# EAGLE design main (EAGLE 7.7.0)
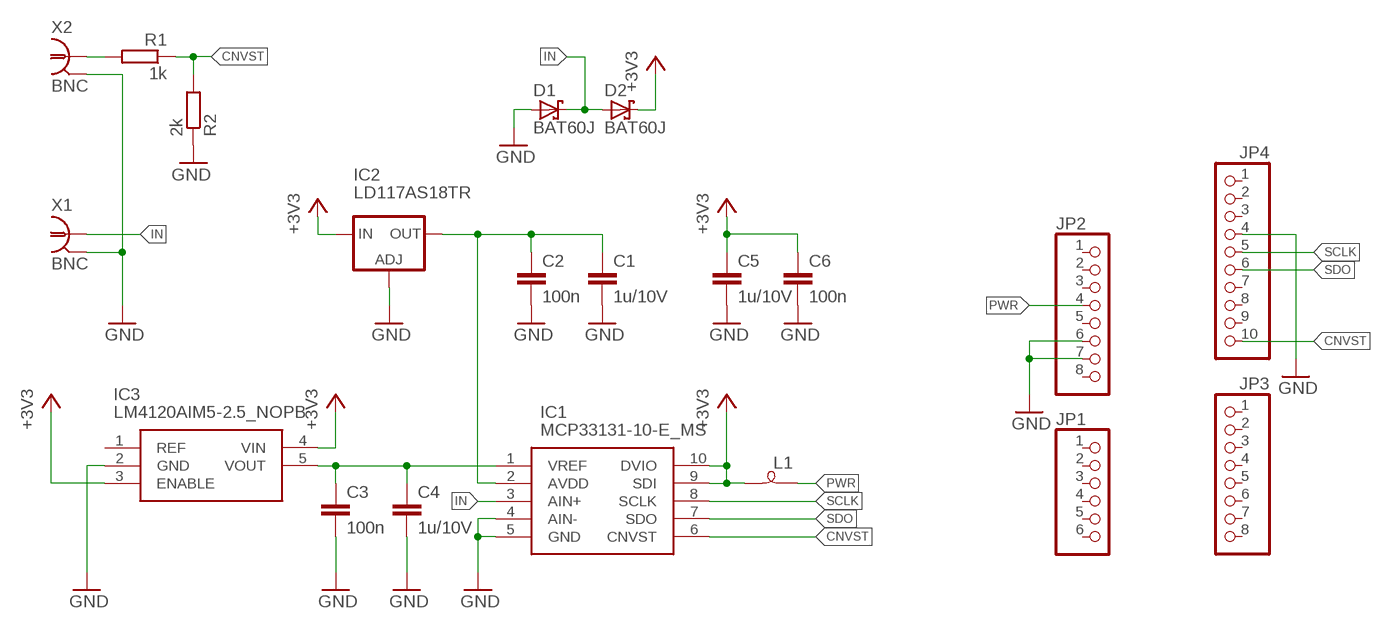
[diagram p0: schematic, sheet 1]

## Parts
C1  1u/10V  C-EUC1206  [C1206]
C2  100n  C-EUC0805  [C0805]
C3  100n  C-EUC0805  [C0805]
C4  1u/10V  C-EUC1206  [C1206]
C5  1u/10V  C-EUC1206  [C1206]
C6  100n  C-EUC0805  [C0805]
D1  BAT60J  [SOD323_ST]
D2  BAT60J  [SOD323_ST]
IC1  MCP33131-10-E_MS  [SOP50P490X110-10N]
IC2  LD117AS18TR  [SOT223]
IC3  LM4120AIM5-2.5_NOPB  [SOT95P280X145-5N]
JP1  PINHD-1X6  [1X06]
JP2  PINHD-1X8  [1X08]
JP3  PINHD-1X8  [1X08]
JP4  PINHD-1X10  [1X10]
L1  SM-B5  [SM-B5]
R1  1k  R-EU_R0805  [R0805]
R2  2k  R-EU_R0805  [R0805]
X1  BNC  1-227161-2  [AMP_227161]
X2  BNC  1-227161-2  [AMP_227161]

## Nets
+3V3: C5.1 C6.1 D2.C IC1.9(SDI) IC1.10(DVIO) IC2.3(IN) IC3.3(ENABLE) IC3.4(VIN) L1.2
CNVST: IC1.6(CNVST) JP4.10 R1.1 R2.2
GND: C1.2 C2.2 C3.2 C4.2 C5.2 C6.2 D1.A IC1.4(AIN-) IC1.5(GND) IC2.1(ADJ) IC3.2(GND) JP2.6 JP2.7 JP4.4 R2.1 X1.2 X2.2
IN: D1.C D2.A IC1.3(AIN+) X1.1
N$1: C3.1 C4.1 IC1.1(VREF) IC3.5(VOUT)
N$2: C1.1 C2.1 IC1.2(AVDD) IC2.4(OUT)
N$4: R1.2 X2.1
PWR: JP2.4 L1.1
SCLK: IC1.8(SCLK) JP4.5
SDO: IC1.7(SDO) JP4.6
Unconnected: IC3.1(REF) JP1.1 JP1.2 JP1.3 JP1.4 JP1.5 JP1.6 JP2.1 JP2.2 JP2.3 JP2.5 JP2.8 JP3.1 JP3.2 JP3.3 JP3.4 JP3.5 JP3.6 JP3.7 JP3.8 JP4.1 JP4.2 JP4.3 JP4.7 JP4.8 JP4.9

## Library data of the parts
C1-C6 = rcl:C-EU: CAPACITOR, European symbol
D1 D2 = diode:BAT60J: Schottky barrier diode Source: www.st.com, BAT60J.pdf
IC1 = SamacSys_Parts:MCP33131-10-E_MS: Analog to Digital Converters - ADC 16-bit, 1 Msps, single channel, single-ended SAR ADC Source: Datasheet <http://ww1.microchip.com/downloads/en/DeviceDoc/MCP33131D-Data-Sheet-DS20005947B.pdf>; DESCRIPTION: Analog to Digital Converters - ADC 16-bit, 1 Msps, single channel, single-ended SAR ADC; HEIGHT: 1.1mm; MANUFACTURER_NAME: Microchip; MANUFACTURER_PART_NUMBER: MCP33131-10-E/MS; MOUSER_PART_NUMBER: 579-MCP33131-10-E/MS; MOUSER_PRICE-STOCK: https://www.mouser.co.uk/ProductDetail/Microchip-Technology-Atmel/MCP33131-10-E-MS?qs=byeeYqUIh0P8g72Pz2M%252Brg%3D%3D
IC2 = v-reg:LD117A?*: Low drop fixed and adjustable positive voltage regulators 1 A Source: http://www.st.com/stonline/products/literature/ds/7194/ld1117axx.pdf
IC3 = SamacSys_Parts:LM4120AIM5-2.5_NOPB: 0.2% 50ppm/C Drift Precision Series Voltage Reference with Shutdown Enable Source: Datasheet <http://www.ti.com/lit/ds/symlink/lm4120.pdf>; DESCRIPTION: 0.2% 50ppm/C Drift Precision Series Voltage Reference with Shutdown Enable; HEIGHT: 1.45mm; MANUFACTURER_NAME: Texas Instruments; MANUFACTURER_PART_NUMBER: LM4120AIM5-2.5/NOPB; MOUSER_PART_NUMBER: 926-LM4120AIM525NOPB; MOUSER_PRICE-STOCK: https://www.mouser.co.uk/ProductDetail/Texas-Instruments/LM4120AIM5-25-NOPB?qs=QbsRYf82W3Hmk5wgD0l3%2Fg%3D%3D
JP1 = pinhead:PINHD-1X6: PIN HEADER
JP2 JP3 = pinhead:PINHD-1X8: PIN HEADER
JP4 = pinhead:PINHD-1X10: PIN HEADER
L1 = inductor-neosid:SM-B: INDUCTOR SMD Bead inductor; OC_FARNELL: unknown; OC_NEWARK: unknown
R1 R2 = resistor:R-EU_: RESISTOR, European symbol
X1 X2 = con-coax:?227161*: JACK, RIGHT ANGLE, 50 OHM, PCB, BNC Source: amp_227161.pdf; OC_FARNELL: unknown; OC_NEWARK: unknown

## Board
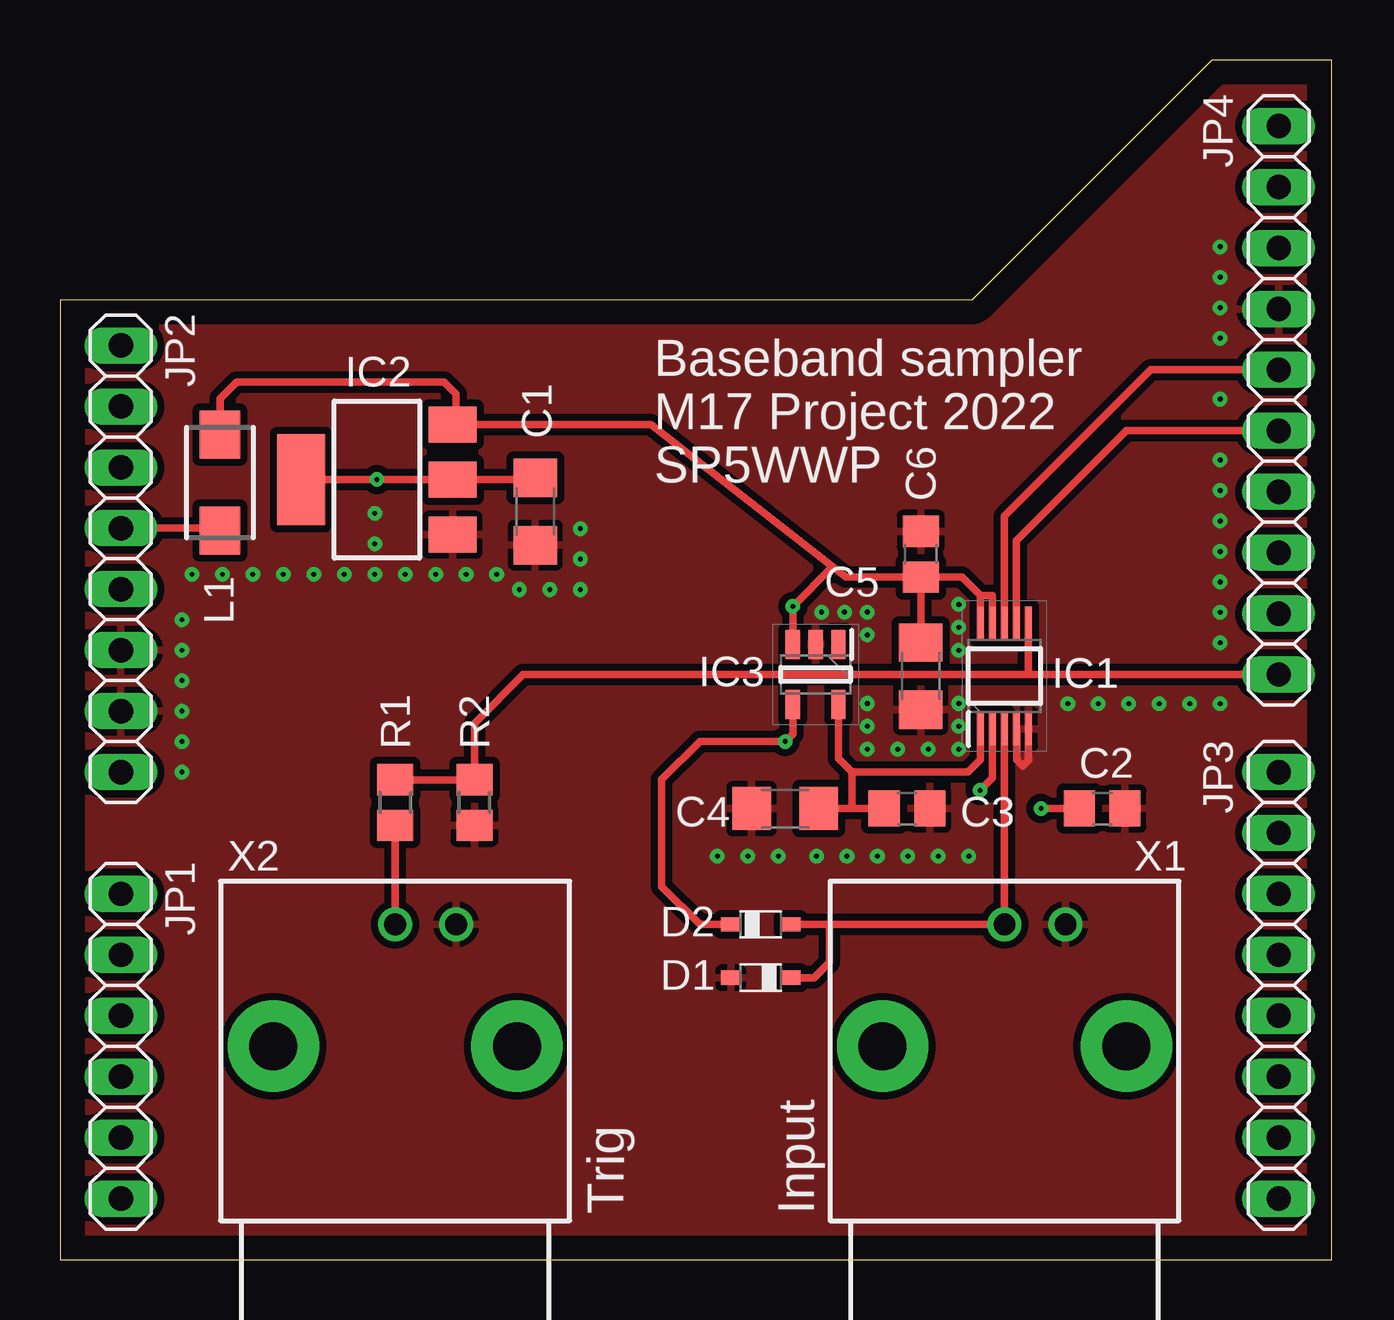
[diagram p1: board, top side]
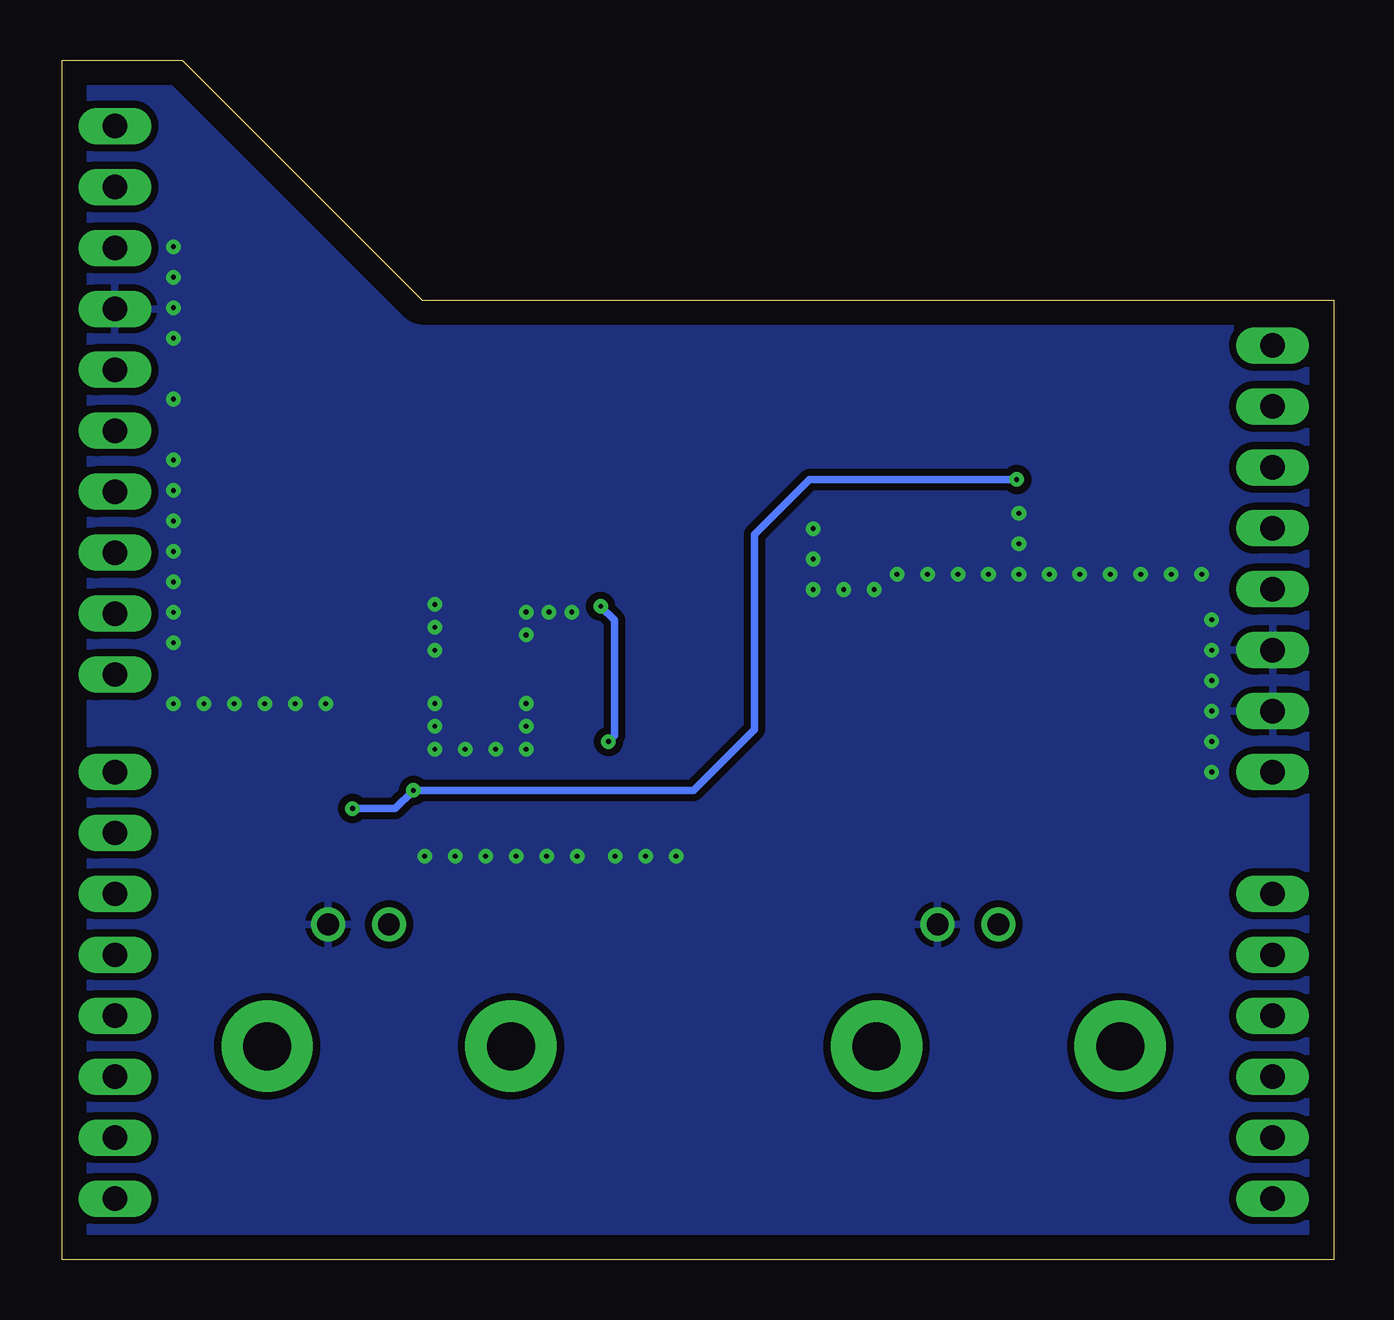
[diagram p2: board, bottom side, seen from below]

Size 53 x 50 mm. Coordinates in mm from the lower left corner, seen from the top.
Outline: 0,0 53,0 53,50 48,50 38,40 0,40 0,0
Copper layers (1*16): Top 0.035mm / dielectric 1.5mm / Bottom 0.035mm
Design rules "default *": minimum track width 10mil, minimum drill 24mil, track to track 8mil, track to pad 8mil, pad to pad 8mil, via to via 8mil, smd to smd 8mil, copper to edge 40mil, drill to drill 8mil, minimum pad ring 10mil, minimum via ring 8mil, stop-mask expansion 4mil, vias tented up to drill 0.2mm, thermal gap 10mil

### Footprints (pad centres in the part's own frame; a part is rotated, then mirrored left to right if it is on the bottom)
C1206 = smd 1.6 x 1.8: 1 -1.4,0; 2 1.4,0
C0805 = smd 1.3 x 1.5: 1 -0.95,0; 2 0.95,0
SOD323_ST = smd 0.8 x 0.6: A 1.25,0; C -1.25,0
SOP50P490X110-10N = smd 1.4 x 0.3: 1 -2.2,1; 2 -2.2,0.5; 3 -2.2,0; 4 -2.2,-0.5; 5 -2.2,-1; 6 2.2,-1; 7 2.2,-0.5; 8 2.2,0; 9 2.2,0.5; 10 2.2,1
SOT223 = smd 1.5 x 2: 1 -2.3,-3.15; 2 0,-3.15; 3 2.3,-3.15 | smd 3.8 x 2: 4 0,3.15
SOT95P280X145-5N = smd 1.2 x 0.6: 1 -1.25,0.95; 2 -1.25,0; 3 -1.25,-0.95; 4 1.25,-0.95; 5 1.25,0.95
1X06 = drill 1.016 long: 1 -6.35,0; 2 -3.81,0; 3 -1.27,0; 4 1.27,0; 5 3.81,0; 6 6.35,0
1X08 = drill 1.016 long: 1 -8.89,0; 2 -6.35,0; 3 -3.81,0; 4 -1.27,0; 5 1.27,0; 6 3.81,0; 7 6.35,0; 8 8.89,0
1X10 = drill 1.016 long: 1 -11.43,0; 2 -8.89,0; 3 -6.35,0; 4 -3.81,0; 5 -1.27,0; 6 1.27,0; 7 3.81,0; 8 6.35,0; 9 8.89,0; 10 11.43,0
SM-B5 = smd 2 x 1.7: 1 -2,0; 2 2,0
R0805 = smd 1.3 x 1.5: 1 -0.95,0; 2 0.95,0
AMP_227161 = drill 0.9 pad 1.27: 1 0,-5.08; 2 -2.54,-5.08 | drill 2 pad 3.81: P$1 -5.08,0; P$2 5.08,0

### Placement (x,y rotation side)
C1  19.81,31.18 270 top
C2  43.43,18.8 0 top
C3  35.31,18.8 0 top
C4  30.23,18.8 180 top
C5  35.88,24.32 270 top
C6  35.88,29.4 90 top
D1  29.21,11.75 180 top
D2  29.21,13.97 0 top
IC1  39.37,24.32 90 top
IC2  13.21,32.51 90 top
IC3  31.5,24.38 270 top
JP1  2.54,8.89 270 top
JP2  2.54,29.21 270 top
JP3  50.8,11.43 270 top
JP4  50.8,35.81 270 top
L1  6.67,32.38 90 top
R1  13.97,19.05 270 top
R2  17.27,19.05 90 top
X1  39.37,8.89 180 top
X2  13.97,8.89 180 top

### Tracks (layer width: path | path; a pad name or v marks a point on that pad's centre or on a via)
+3V3  (via drill 0.2)
  Top 0.305: C6.1 C5.1 | C6.1 37.59,28.45 38.37,27.67 | 38.37,27.67 IC1.10 | C6.1 32.77,28.45 32.2,28.89 | 32.2,28.89 24.64,34.8 16.37,34.8 IC2.3 16.51,34.96 16.51,36.07 16,36.58 7.37,36.58 6.67,35.88 L1.2 | IC3.3 v30.55,27.23 32.2,28.89 | IC1.9 38.87,27.68 38.86,27.69 38.39,27.69 38.37,27.67 | IC3.4 30.55,21.91 v30.23,21.59 26.67,21.59 25.08,20 25.08,15.56 26.67,13.97 D2.C
  Bottom 0.305: v30.23,21.59 29.97,21.84 29.97,26.66 v30.55,27.23
CNVST
  Top 0.305: JP4.10 40.37,24.38 | 40.37,24.38 IC1.6 | 40.37,24.38 19.3,24.38 17.27,22.35 R2.2 R1.1
GND  (via drill 0.2)
  Top 0.305: IC1.4 39.88,20.83 40.13,20.57 40.39,20.83 40.37,20.84 IC1.5
  other vias: 33.66,23.18 33.66,22.23 33.66,21.27 34.92,21.27 36.2,21.27 37.47,21.27 37.47,22.23 37.47,23.18 31.75,26.99 32.7,26.99 33.66,26.99 33.66,26.04 37.47,26.35 37.47,27.3 37.47,25.4 48.36,35.87 48.36,32.05 48.36,33.33 5.08,22.86 5.08,24.13 5.08,25.4 5.08,26.67 5.08,21.59 5.08,20.32 48.36,38.41 48.36,39.67 48.36,40.95 48.36,42.22 48.36,30.79 48.36,29.52 48.36,28.25 48.36,26.98 48.36,25.7 48.36,23.16 47.09,23.16 45.82,23.16 44.55,23.16 43.28,23.16 42.01,23.16 13.12,31.1 13.12,29.83 13.12,28.56 14.39,28.56 15.66,28.56 16.93,28.56 18.2,28.56 19.15,27.93 20.42,27.93 21.69,27.93 21.69,29.2 21.69,30.47 11.85,28.56 10.58,28.56 9.31,28.56 8.04,28.56 6.77,28.56 5.5,28.56 28.68,16.82 27.41,16.82 29.95,16.82 31.53,16.82 32.8,16.82 34.07,16.82 35.34,16.82 36.61,16.82 37.88,16.82
  pour Top (isolate 0.3): 0,0 53,0 53,50 48,50 38,40 0,40
  pour Bottom (isolate 0.3): 0,0 53,0 53,50 48,50 38,40 0,40
IN
  Top 0.305: IC1.3 X1.1 32.07,13.97 | D2.A 32.07,13.97 | D1.C 31.43,11.75 32.07,12.38 32.07,13.97
N$1
  Top 0.305: C3.1 33.02,18.8 | 33.02,18.8 C4.1 | IC3.5 32.45,20.89 33.02,20.32 | 33.02,20.32 33.02,18.8 | IC1.1 38.37,20.84 37.85,20.32 33.02,20.32
N$2  (via drill 0.2)
  Top 0.305: IC1.2 38.87,20.07 v38.35,19.56 | IC2.4 v13.21,32.51 19.75,32.51 C1.1 | C2.1 v40.89,18.8
  Bottom 0.305: v13.21,32.51 21.84,32.51 24.13,30.23 24.13,22.1 26.67,19.56 v38.35,19.56 39.12,18.8 v40.89,18.8
N$4
  Top 0.305: R1.2 X2.1
PWR
  Top 0.305: L1.1 6.57,30.48 JP2.4
SCLK
  Top 0.305: IC1.8 39.37,30.99 45.47,37.08 JP4.5
SDO
  Top 0.305: JP4.6 44.45,34.54 39.87,29.96 IC1.7

### Text on the board
tNames: Baseband sampler | M17 Project 2022 | SP5WWP | Trig | Input